# EasyEDA Pro project ProProject_SmartNixieClock_2023-12-15.epro, board Main_1
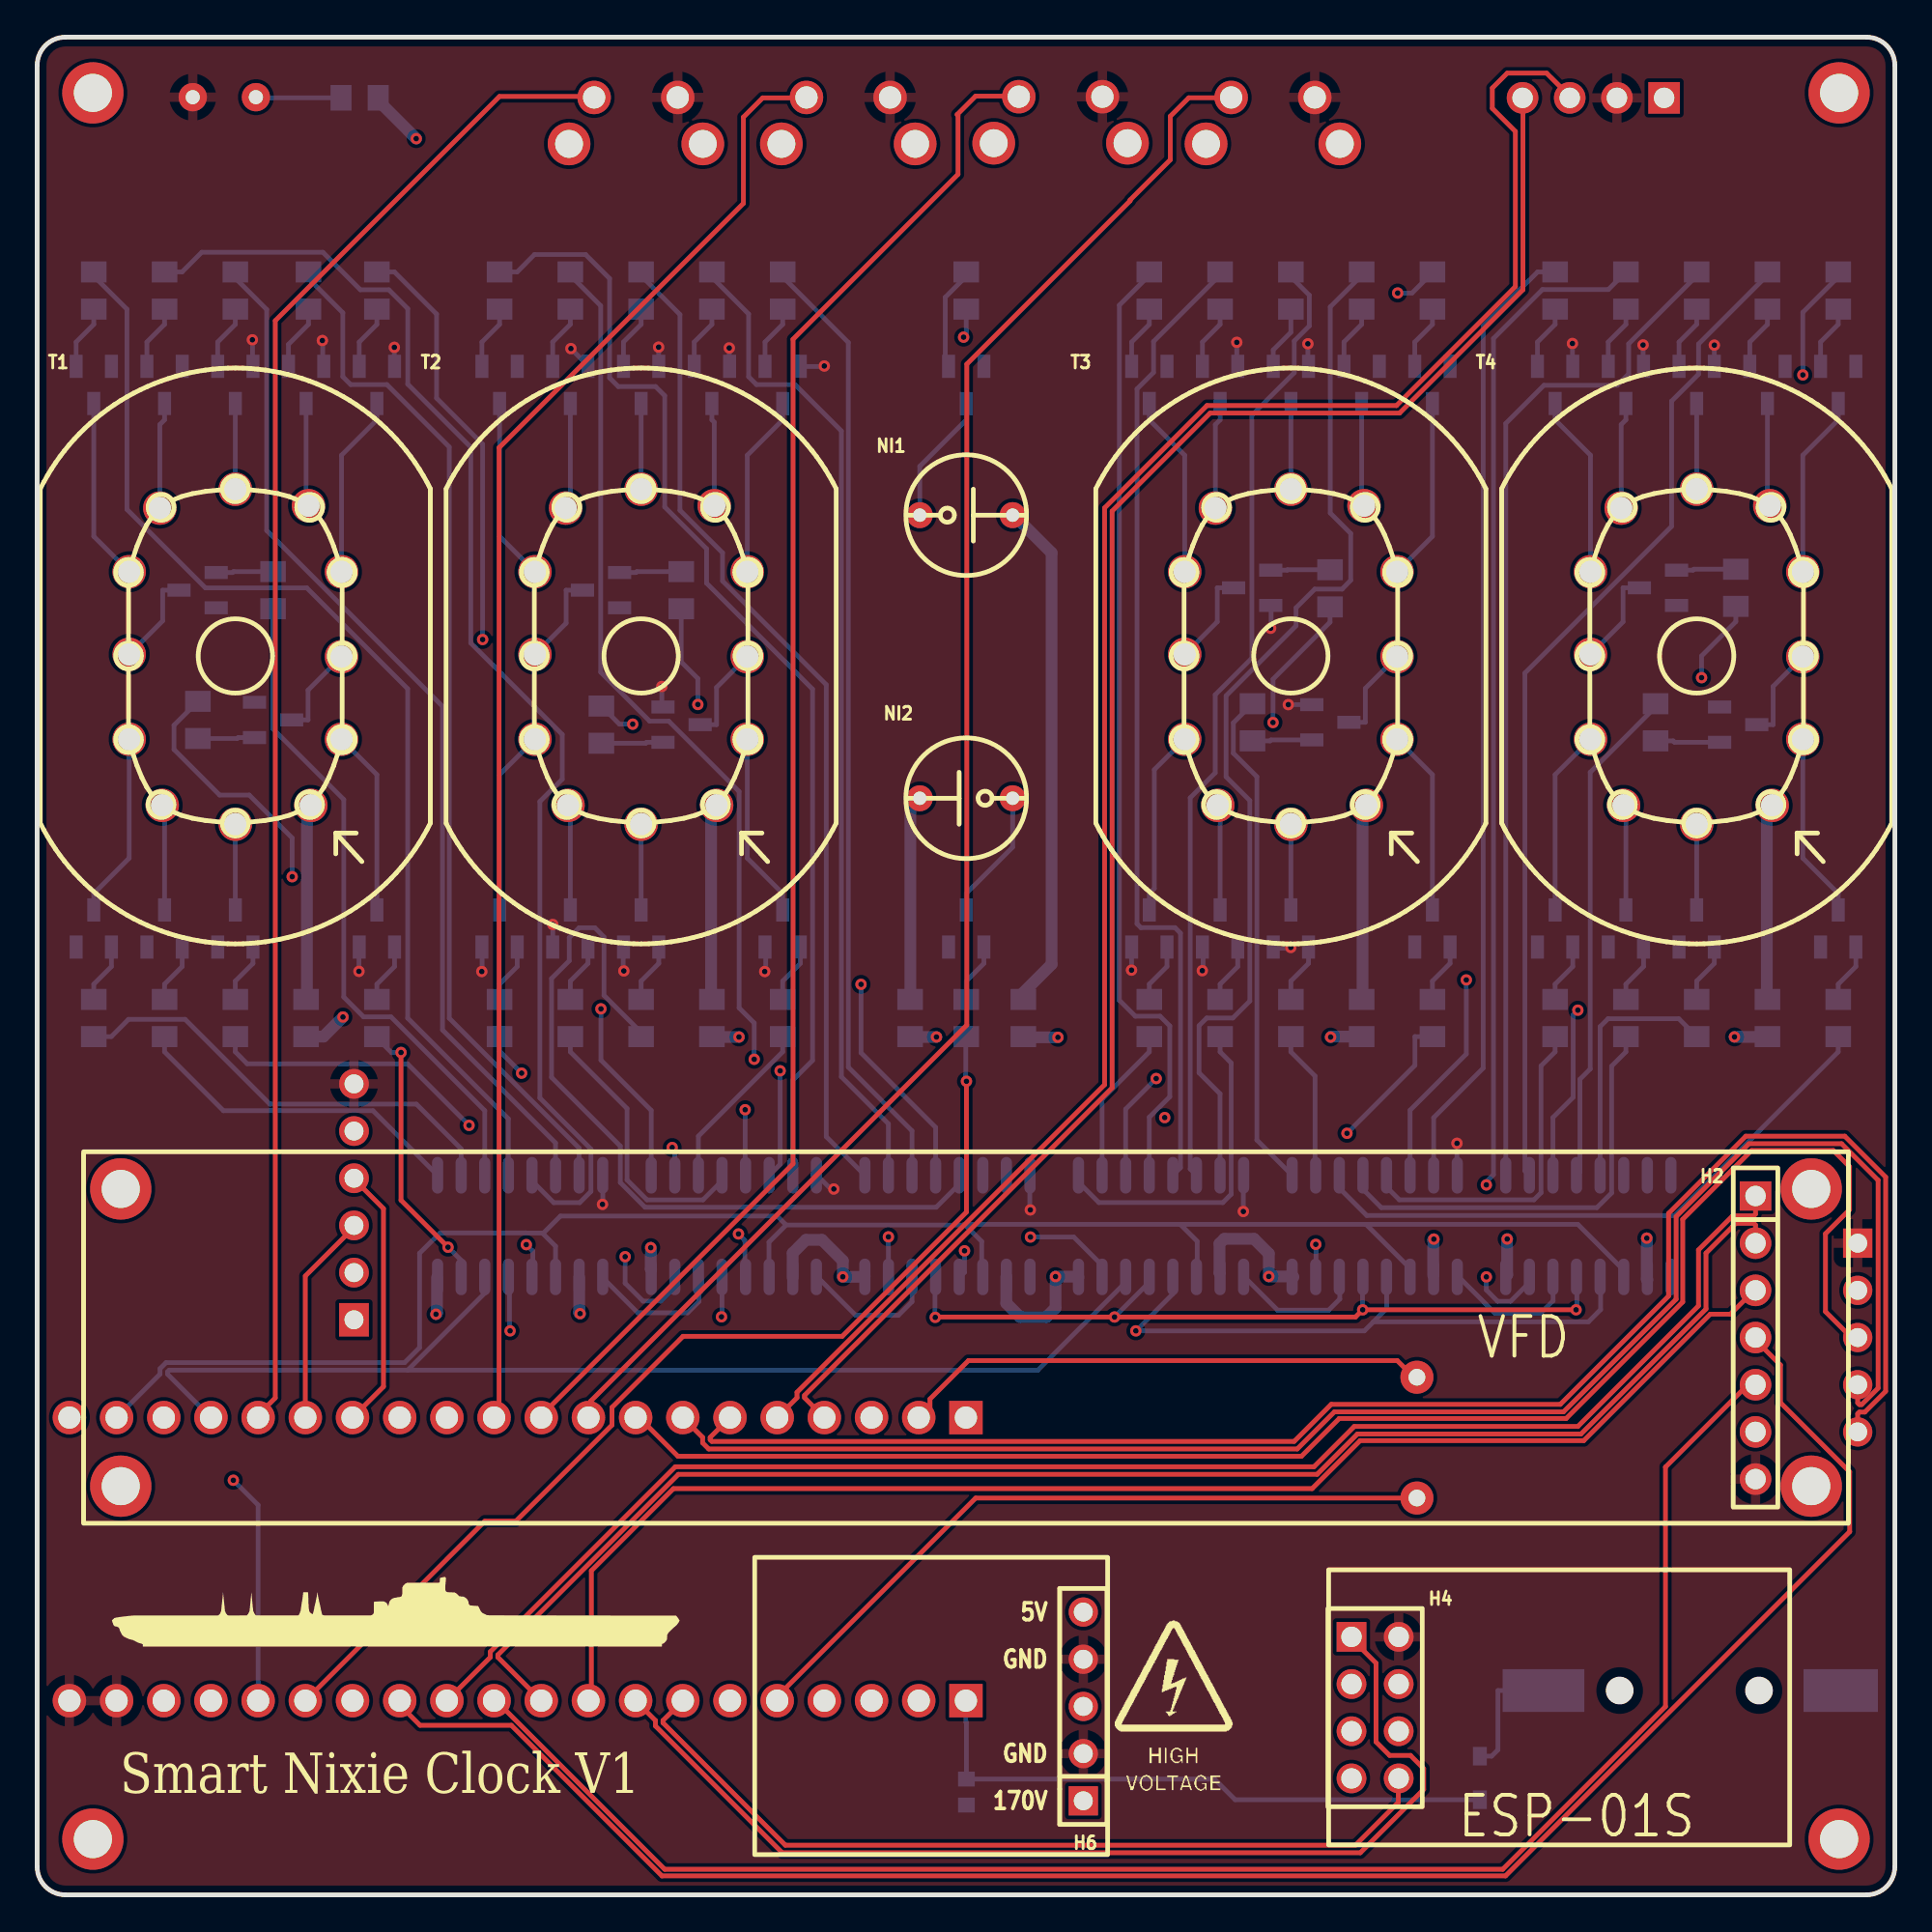
[diagram p2: board, top side]
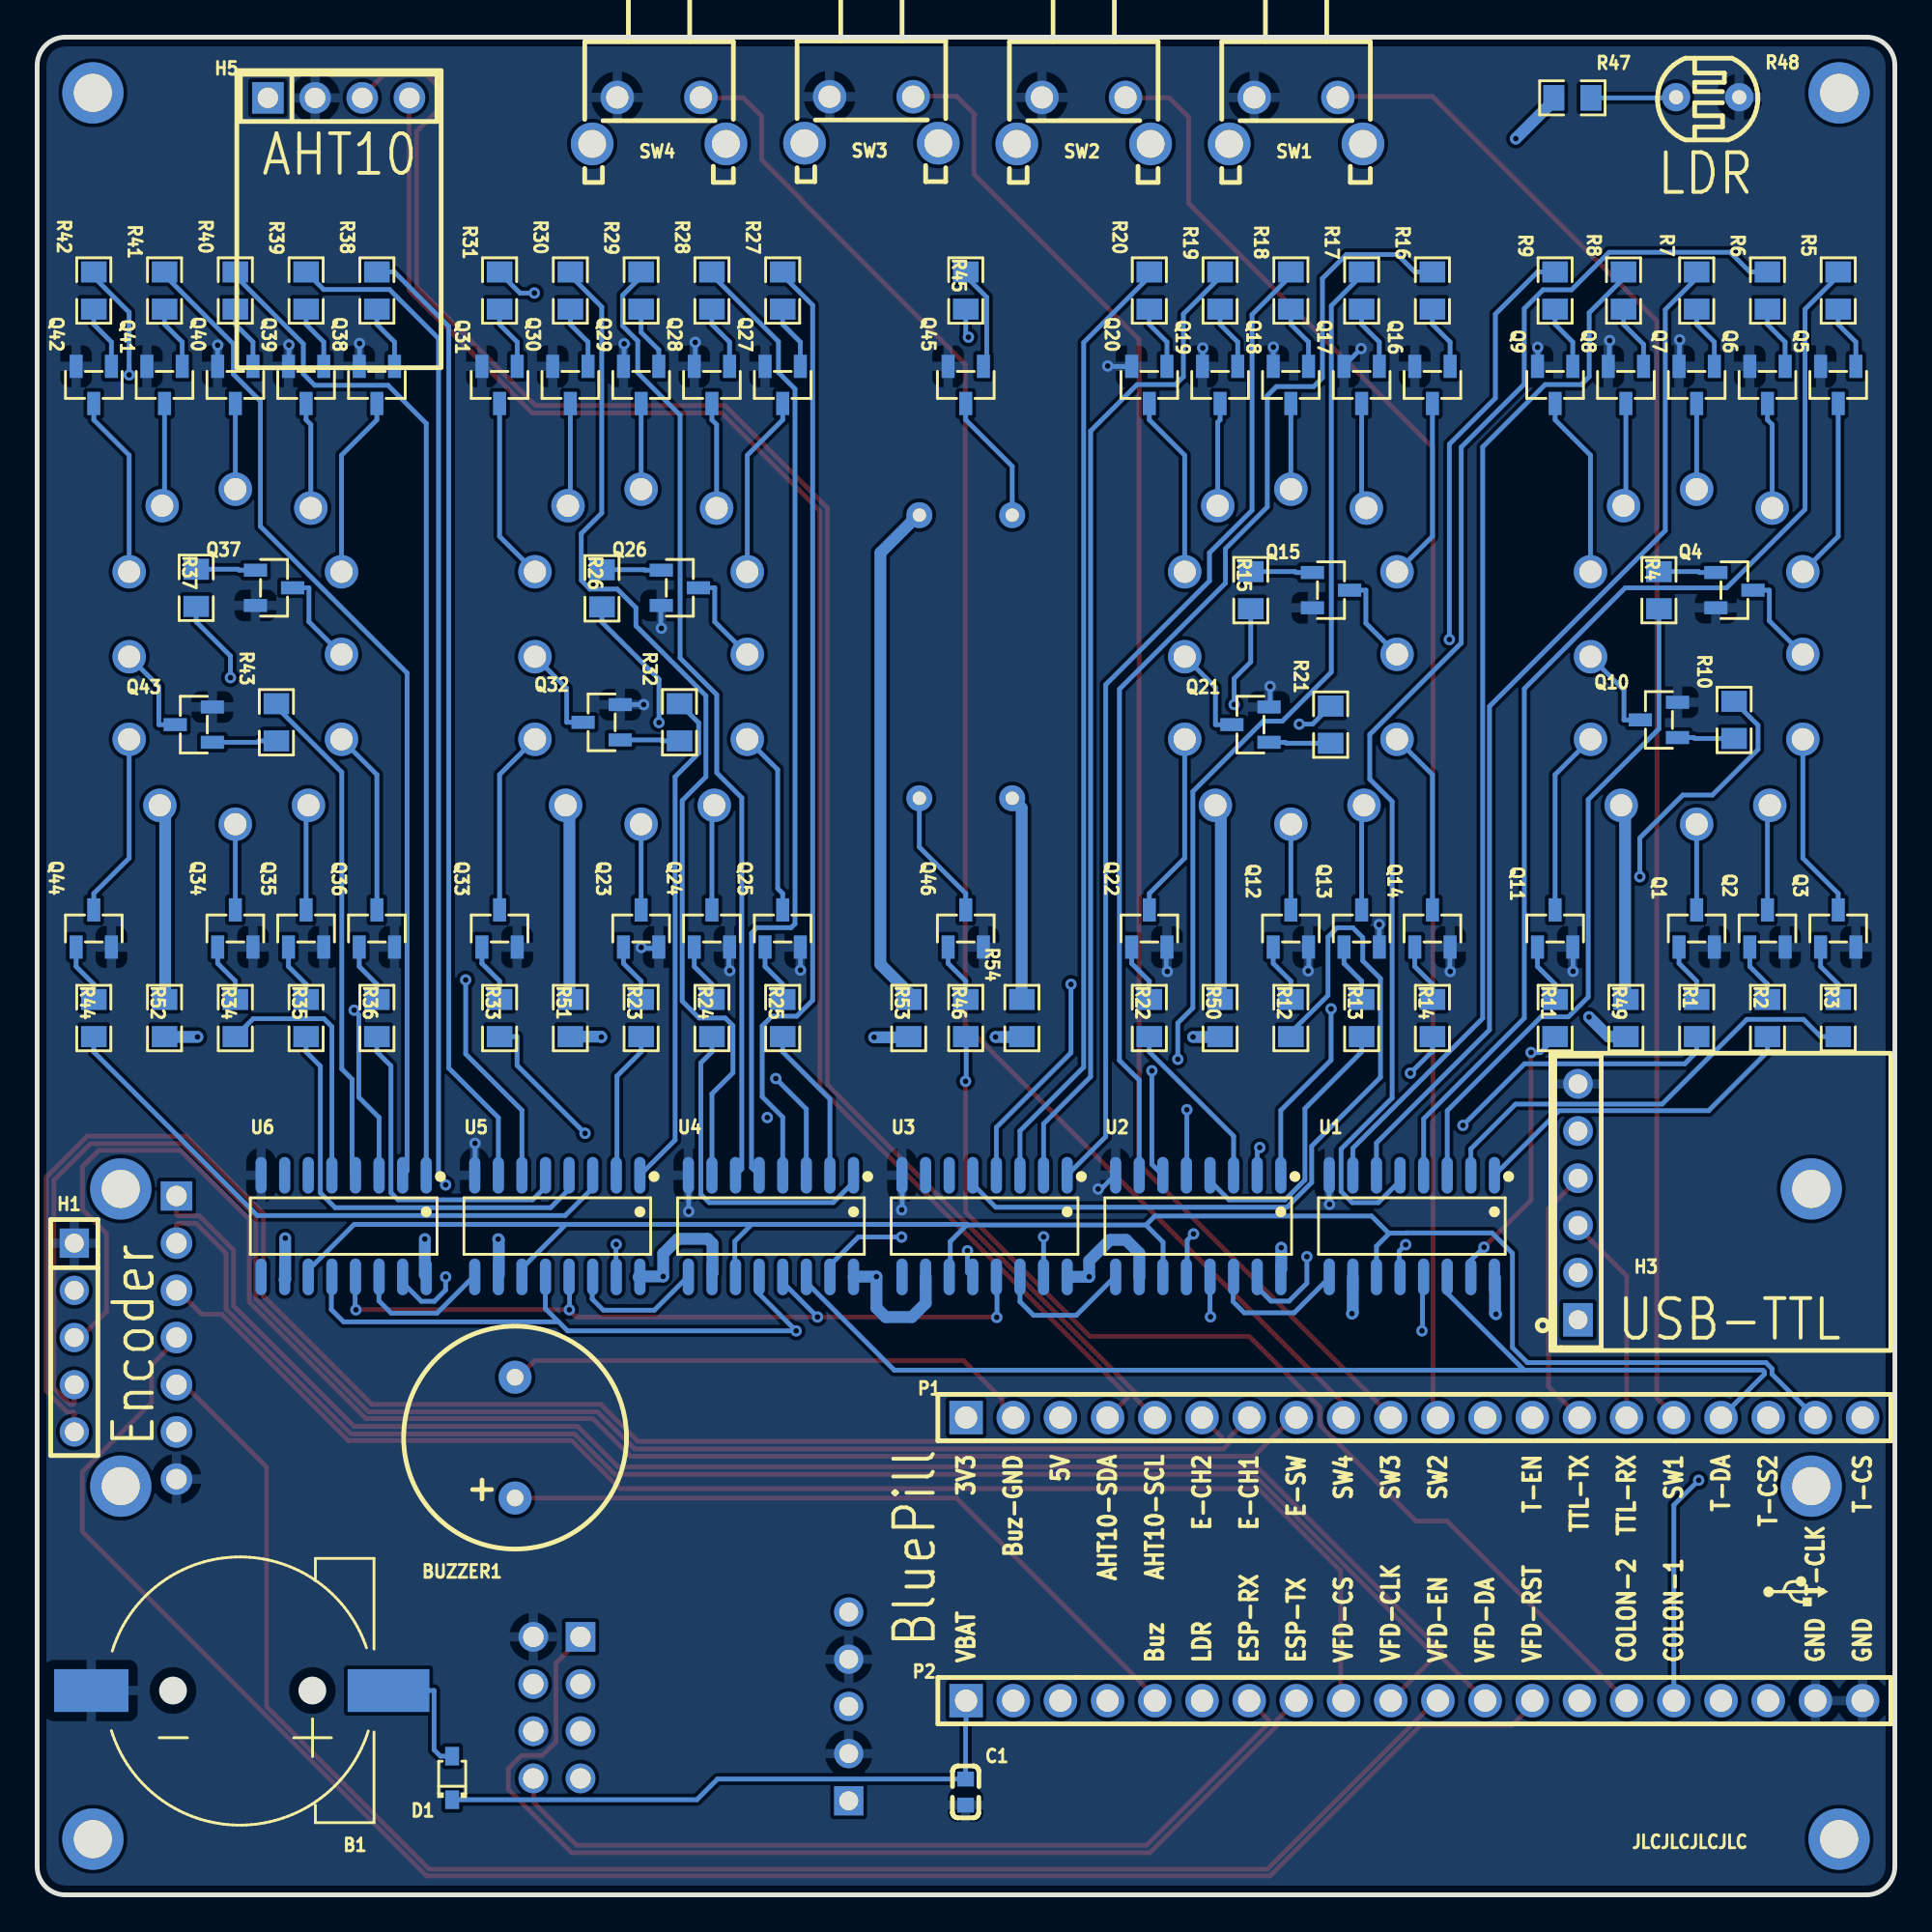
[diagram p3: board, bottom side, seen from below]

Outline 100 x 100 mm; copper layers: Top Layer, Inner1, Inner2, Bottom Layer. Coordinates in mm from the lower left corner of the outline.
Outline path: 0,98.48 0,1.52 arc(0.45,0.45) 1.52,0 98.48,0 arc(99.55,0.45) 100,1.52 100,98.48 arc(99.55,99.55) 98.48,100 1.52,100 arc(0.45,99.55) 0,98.48
Stack: Top Layer 0.035mm 外层铜厚1oz / Dielectric1 0.2104mm 7628 RC49% 8.6mil / Inner1 0.0152mm 内层铜厚 / Dielectric2 1.065mm 1.1mm H/HOZ 含铜 / Inner2 0.0152mm 内层铜厚 / Dielectric3 0.2104mm 7628 RC49% 8.6mil / Bottom Layer 0.035mm 外层铜厚1oz

## Design rules (mm)
template: 用户自定义配置
spacing copperThickness1oz (default): track to track 0.102, other pairs 0.152 to 0.3
spacing copperThickness2oz: track to track 0.203, other pairs 0.152 to 0.3
spacing copperThicknessInner0.5oz: track to track 0.089, other pairs 0.152 to 0.3
track width copperThickness1oz (default): min 0.102, default 0.254, max 2.54
track width copperThickness2oz: min 0.203, default 0.254, max 2.54
track width copperThickness0.5oz: min 0.089, default 0.254, max 2.54
track width +5V: min 0.635, default 0.635, max 2.54
track width +3V3: min 0.635, default 0.635, max 2.54
track width +170V: min 0.635, default 0.635, max 2.54
differential pair differentialPair (default): width min 0.127, default 0.254, max 2.54; gap min 0.152, default 0.152
via viaSize (default): diameter min 0.3, default 0.61, max 10; hole min 0.201, default 0.305, max 6.299
net +5V uses +5V
net $1N105872 uses +170V
net $1N105896 uses +170V
net $1N105920 uses +170V
net $1N105944 uses +170V
net $1N105947 uses +170V
net $1N105948 uses +170V
net +3V3 uses +3V3
net +170V uses +170V

## Placement (name value [footprint] x y rotation side)
B1  CR1220-2  [BAT-SMD_CR1220-2]  89.09 11 0 bottom
BUZZER1  2048Hz  [BUZ-TH_BD12.0-P6.50-D0.6-FD]  74.27 24.61 90 bottom
C1  100nF  [C0603]  50.02 5.53 270 bottom
D1  1N4148WS  [SOD-323_L1.8-W1.3-LS2.5-RD]  77.66 6.29 90 bottom
H1  PM254V-11-05-H85  [HDR-TH_5P-P2.54-V-F]  98 30 270 bottom
H2  PM254V-11-07-H85  [HDR-TH_7P-P2.54-V-F]  92.5 30 270 top
H3  PM254V-11-06-H85  [HDR-TH_6P-P2.54-V-F]  17.06 37.31 90 bottom
H4  PM254V-12-08-H85  [HDR-TH_8P-P2.54-V-F-R2-C4-S2.54]  72.02 10.08 270 top
H5  PM254V-11-04-H85  [HDR-TH_4P-P2.54-V-F]  83.77 96.73 180 bottom
H6  PM254V-11-05-H85  [HDR-TH_5P-P2.54-V-F]  56.31 10.14 90 top
NI1  -  [INS-1]  50.01 74.27 0 top
NI2  -  [INS-1]  50.01 59.03 180 top
NOREF  -  [Pad_e46]  95.5 22 0 top
NOREF#2  -  [Pad_e40]  4.5 38 0 top
NOREF#3  -  [Pad_e51]  95.5 38 0 top
NOREF#4  -  [Pad_e54]  97 3 0 top
NOREF#5  -  [Pad_e58]  3 3 0 top
NOREF#6  -  [Pad_e45]  4.5 22 0 top
NOREF#7  -  [Pad_e55]  97 97 0 top
NOREF#8  -  [Pad_e57]  3 97 0 top
P1  2.54-1*20P母  [HDR-TH_20P-P2.54-V-F]  25.87 25.69 180 bottom
P2  2.54-1*20P母  [HDR-TH_20P-P2.54-V-F]  25.87 10.45 180 bottom
Q1  13001  [SOT-23-3_L2.9-W1.3-P1.90-LS2.4-BR]  10.67 52.02 270 bottom
Q2  13001  [SOT-23-3_L2.9-W1.3-P1.90-LS2.4-BR]  6.86 52.02 270 bottom
Q3  13001  [SOT-23-3_L2.9-W1.3-P1.90-LS2.4-BR]  3.05 52.02 270 bottom
Q4  13001  [SOT-23-3_L2.9-W1.3-P1.90-LS2.4-BR]  8.64 70.23 0 bottom
Q5  13001  [SOT-23-3_L2.9-W1.3-P1.90-LS2.4-BR]  3.05 81.28 90 bottom
Q6  13001  [SOT-23-3_L2.9-W1.3-P1.90-LS2.4-BR]  6.86 81.28 90 bottom
Q7  13001  [SOT-23-3_L2.9-W1.3-P1.90-LS2.4-BR]  10.67 81.28 90 bottom
Q8  13001  [SOT-23-3_L2.9-W1.3-P1.90-LS2.4-BR]  14.48 81.28 90 bottom
Q9  13001  [SOT-23-3_L2.9-W1.3-P1.90-LS2.4-BR]  18.29 81.28 90 bottom
Q10  13001  [SOT-23-3_L2.9-W1.3-P1.90-LS2.4-BR]  12.7 63.25 180 bottom
Q11  13001  [SOT-23-3_L2.9-W1.3-P1.90-LS2.4-BR]  18.29 52.02 270 bottom
Q12  13001  [SOT-23-3_L2.9-W1.3-P1.90-LS2.4-BR]  32.51 52.02 270 bottom
Q13  13001  [SOT-23-3_L2.9-W1.3-P1.90-LS2.4-BR]  28.7 52.02 270 bottom
Q14  13001  [SOT-23-3_L2.9-W1.3-P1.90-LS2.4-BR]  24.89 52.02 270 bottom
Q15  13001  [SOT-23-3_L2.9-W1.3-P1.90-LS2.4-BR]  30.35 70.23 0 bottom
Q16  13001  [SOT-23-3_L2.9-W1.3-P1.90-LS2.4-BR]  24.89 81.28 90 bottom
Q17  13001  [SOT-23-3_L2.9-W1.3-P1.90-LS2.4-BR]  28.7 81.28 90 bottom
Q18  13001  [SOT-23-3_L2.9-W1.3-P1.90-LS2.4-BR]  32.51 81.28 90 bottom
Q19  13001  [SOT-23-3_L2.9-W1.3-P1.90-LS2.4-BR]  36.32 81.28 90 bottom
Q20  13001  [SOT-23-3_L2.9-W1.3-P1.90-LS2.4-BR]  40.13 81.28 90 bottom
Q21  13001  [SOT-23-3_L2.9-W1.3-P1.90-LS2.4-BR]  34.69 62.99 180 bottom
Q22  13001  [SOT-23-3_L2.9-W1.3-P1.90-LS2.4-BR]  40.13 52.02 270 bottom
Q23  13001  [SOT-23-3_L2.9-W1.3-P1.90-LS2.4-BR]  67.49 52.02 270 bottom
Q24  13001  [SOT-23-3_L2.9-W1.3-P1.90-LS2.4-BR]  63.68 52.02 270 bottom
Q25  13001  [SOT-23-3_L2.9-W1.3-P1.90-LS2.4-BR]  59.87 52.02 270 bottom
Q26  13001  [SOT-23-3_L2.9-W1.3-P1.90-LS2.4-BR]  65.41 70.36 0 bottom
Q27  13001  [SOT-23-3_L2.9-W1.3-P1.90-LS2.4-BR]  59.87 81.28 90 bottom
Q28  13001  [SOT-23-3_L2.9-W1.3-P1.90-LS2.4-BR]  63.68 81.28 90 bottom
Q29  13001  [SOT-23-3_L2.9-W1.3-P1.90-LS2.4-BR]  67.49 81.28 90 bottom
Q30  13001  [SOT-23-3_L2.9-W1.3-P1.90-LS2.4-BR]  71.3 81.28 90 bottom
Q31  13001  [SOT-23-3_L2.9-W1.3-P1.90-LS2.4-BR]  75.11 81.28 90 bottom
Q32  13001  [SOT-23-3_L2.9-W1.3-P1.90-LS2.4-BR]  69.61 63.12 180 bottom
Q33  13001  [SOT-23-3_L2.9-W1.3-P1.90-LS2.4-BR]  75.11 52.02 270 bottom
Q34  13001  [SOT-23-3_L2.9-W1.3-P1.90-LS2.4-BR]  89.33 52.02 270 bottom
Q35  13001  [SOT-23-3_L2.9-W1.3-P1.90-LS2.4-BR]  85.52 52.02 270 bottom
Q36  13001  [SOT-23-3_L2.9-W1.3-P1.90-LS2.4-BR]  81.71 52.02 270 bottom
Q37  13001  [SOT-23-3_L2.9-W1.3-P1.90-LS2.4-BR]  87.25 70.36 0 bottom
Q38  13001  [SOT-23-3_L2.9-W1.3-P1.90-LS2.4-BR]  81.71 81.28 90 bottom
Q39  13001  [SOT-23-3_L2.9-W1.3-P1.90-LS2.4-BR]  85.52 81.28 90 bottom
Q40  13001  [SOT-23-3_L2.9-W1.3-P1.90-LS2.4-BR]  89.33 81.28 90 bottom
Q41  13001  [SOT-23-3_L2.9-W1.3-P1.90-LS2.4-BR]  93.14 81.28 90 bottom
Q42  13001  [SOT-23-3_L2.9-W1.3-P1.90-LS2.4-BR]  96.95 81.28 90 bottom
Q43  13001  [SOT-23-3_L2.9-W1.3-P1.90-LS2.4-BR]  91.57 62.99 180 bottom
Q44  13001  [SOT-23-3_L2.9-W1.3-P1.90-LS2.4-BR]  96.95 52.02 270 bottom
Q45  13001  [SOT-23-3_L2.9-W1.3-P1.90-LS2.4-BR]  50.01 81.28 90 bottom
Q46  13001  [SOT-23-3_L2.9-W1.3-P1.90-LS2.4-BR]  50.01 52.02 270 bottom
R1  1kΩ  [R0805]  10.67 47.2 90 bottom
R2  1kΩ  [R0805]  6.86 47.2 90 bottom
R3  1kΩ  [R0805]  3.05 47.2 90 bottom
R4  1kΩ  [R0805]  12.7 70.23 90 bottom
R5  1kΩ  [R0805]  3.05 86.36 270 bottom
R6  1kΩ  [R0805]  6.86 86.36 270 bottom
R7  1kΩ  [R0805]  10.67 86.36 270 bottom
R8  1kΩ  [R0805]  14.61 86.36 270 bottom
R9  1kΩ  [R0805]  18.29 86.36 270 bottom
R10  1kΩ  [R0805]  8.65 63.25 270 bottom
R11  1kΩ  [R0805]  18.29 47.2 90 bottom
R12  1kΩ  [R0805]  32.51 47.2 90 bottom
R13  1kΩ  [R0805]  28.7 47.2 90 bottom
R14  1kΩ  [R0805]  24.89 47.2 90 bottom
R15  1kΩ  [R0805]  34.67 70.23 90 bottom
R16  1kΩ  [R0805]  24.89 86.36 270 bottom
R17  1kΩ  [R0805]  28.7 86.36 270 bottom
R18  1kΩ  [R0805]  32.51 86.36 270 bottom
R19  1kΩ  [R0805]  36.32 86.36 270 bottom
R20  1kΩ  [R0805]  40.13 86.36 270 bottom
R21  1kΩ  [R0805]  30.37 62.99 270 bottom
R22  1kΩ  [R0805]  40.13 47.2 90 bottom
R23  1kΩ  [R0805]  67.49 47.2 90 bottom
R24  1kΩ  [R0805]  63.68 47.2 90 bottom
R25  1kΩ  [R0805]  59.87 47.2 90 bottom
R26  1kΩ  [R0805]  69.6 70.33 90 bottom
R27  1kΩ  [R0805]  59.87 86.36 270 bottom
R28  1kΩ  [R0805]  63.68 86.36 270 bottom
R29  1kΩ  [R0805]  67.49 86.36 270 bottom
R30  1kΩ  [R0805]  71.3 86.36 270 bottom
R31  1kΩ  [R0805]  75.11 86.36 270 bottom
R32  1kΩ  [R0805]  65.42 63.12 270 bottom
R33  1kΩ  [R0805]  75.11 47.2 90 bottom
R34  1kΩ  [R0805]  89.33 47.2 90 bottom
R35  1kΩ  [R0805]  85.52 47.2 90 bottom
R36  1kΩ  [R0805]  81.71 47.2 90 bottom
R37  1kΩ  [R0805]  91.44 70.36 90 bottom
R38  1kΩ  [R0805]  81.71 86.36 270 bottom
R39  1kΩ  [R0805]  85.52 86.36 270 bottom
R40  1kΩ  [R0805]  89.33 86.36 270 bottom
R41  1kΩ  [R0805]  93.14 86.36 270 bottom
R42  1kΩ  [R0805]  96.95 86.36 270 bottom
R43  1kΩ  [R0805]  87.12 63.12 270 bottom
R44  1kΩ  [R0805]  96.95 47.2 90 bottom
R45  1kΩ  [R0805]  50.01 86.36 90 bottom
R46  1kΩ  [R0805]  50.01 47.2 90 bottom
R47  10kΩ  [R0805]  17.36 96.73 0 bottom
R48  GL5516  [RES-TH_L5.1-W4.3-P3.40-D0.5]  10.08 96.77 90 bottom
R49  20kΩ  [R0805]  14.48 47.2 90 bottom
R50  20kΩ  [R0805]  36.32 47.2 90 bottom
R51  20kΩ  [R0805]  71.3 47.2 90 bottom
R52  20kΩ  [R0805]  93.14 47.2 90 bottom
R53  200kΩ  [R0805]  53.09 47.2 90 bottom
R54  200kΩ  [R0805]  46.99 47.2 270 bottom
SW1  TS-1093C-A13B2-D1  [SW-TH_TS-1093C-A13B3-D1]  32.23 95.5 0 bottom
SW2  TS-1093C-A13B2-D1  [SW-TH_TS-1093C-A13B3-D1]  43.66 95.5 0 bottom
SW3  TS-1093C-A13B2-D1  [SW-TH_TS-1093C-A13B3-D1]  55.09 95.54 0 bottom
SW4  TS-1093C-A13B2-D1  [SW-TH_TS-1093C-A13B3-D1]  66.52 95.5 0 bottom
T1  IN-12b辉光管  [IN-12b(正常,插針在上面)]  10.67 66.65 0 top
T2  IN-12b辉光管  [IN-12b(正常,插針在上面)]  32.51 66.65 0 top
T3  IN-12b辉光管  [IN-12b(正常,插針在上面)]  67.49 66.65 0 top
T4  IN-12b辉光管  [IN-12b(正常,插針在上面)]  89.33 66.65 0 top
U1  74HC595D,118  [SOIC-16_L9.9-W3.9-P1.27-LS6.0-BL]  26 36 0 bottom
U2  74HC595D,118  [SOIC-16_L9.9-W3.9-P1.27-LS6.0-BL]  37.5 36 0 bottom
U3  74HC595D,118  [SOIC-16_L9.9-W3.9-P1.27-LS6.0-BL]  49 36 0 bottom
U4  74HC595D,118  [SOIC-16_L9.9-W3.9-P1.27-LS6.0-BL]  60.5 36 0 bottom
U5  74HC595D,118  [SOIC-16_L9.9-W3.9-P1.27-LS6.0-BL]  72 36 0 bottom
U6  74HC595D,118  [SOIC-16_L9.9-W3.9-P1.27-LS6.0-BL]  83.5 36 0 bottom

## Footprints (pads in the part's own frame, mm; a bottom-side part is the same pattern mirrored in y, then rotated)
BAT-SMD_CR1220-2
  rect 4.4x2.3 smd: 1(-8,0)
  rect 4x2.3 smd: 2(8,0)
BUZ-TH_BD12.0-P6.50-D0.6-FD
  round 1.778 hole 0.9: 1(-3.251,0) 2(3.251,0)
C0603
  rect 0.8x0.9 smd: 1(-0.7,0) 2(0.7,0)
HDR-TH_4P-P2.54-V-F
  rect 1.7x1.7 hole 1.1: 1(-3.81,0)
  round 1.7 hole 1.1: 2(-1.27,0) 3(1.27,0) 4(3.81,0)
HDR-TH_5P-P2.54-V-F
  rect 1.575x1.575 hole 1.02: 1(-5.08,0)
  round 1.575 hole 1.02: 2(-2.54,0) 3(0,0) 4(2.54,0) 5(5.08,0)
HDR-TH_6P-P2.54-V-F
  rect 1.8x1.6 hole 1.02: 1(-6.35,0)
  round 1.6 hole 1.02: 2(-3.81,0) 3(-1.27,0) 4(1.27,0) 5(3.81,0) 6(6.35,0)
HDR-TH_7P-P2.54-V-F
  rect 1.575x1.7 hole 1.1: 1(-7.62,0)
  round 1.7 hole 1.1: 2(-5.08,0) 3(-2.54,0) 4(0,0) 5(2.54,0) 6(5.08,0) 7(7.62,0)
HDR-TH_8P-P2.54-V-F-R2-C4-S2.54
  rect 1.6x1.6 hole 1.1: 1(-3.81,-1.27)
  round 1.6 hole 1.1: 2(-3.81,1.27) 3(-1.27,-1.27) 4(-1.27,1.27) 5(1.27,-1.27) 6(1.27,1.27) 7(3.81,-1.27) 8(3.81,1.27)
HDR-TH_20P-P2.54-V-F
  rect 1.8x1.8 hole 1.2: 1(-24.13,0)
  round 1.8 hole 1.2: 2(-21.59,0) 3(-19.05,0) 4(-16.51,0) 5(-13.97,0) 6(-11.43,0) 7(-8.89,0) 8(-6.35,0) 9(-3.81,0) 10(-1.27,0) 11(1.27,0) 12(3.81,0) 13(6.35,0) 14(8.89,0) 15(11.43,0) 16(13.97,0) 17(16.51,0) 18(19.05,0) 19(21.59,0) 20(24.13,0)
IN-12b(正常,插針在上面)
  round 1.8 hole 1.2x1.05: 1(4.064,-8.001) 2(5.715,-4.445) 3(5.715,0) 4(5.715,4.572) 5(3.937,8.128) 6(0,9.017) 7(-4.064,8.001) 8(-5.715,4.572) 9(-5.715,0.127) 10(-5.715,-4.445) 11(-3.937,-8.001) 12(0,-9.017)
INS-1
  round 1.4 hole 0.72: 1(2.5,0) 2(-2.5,0)
Pad_e40
  round 3.3 hole 2.05: M2(0,0)
Pad_e45
  round 3.3 hole 2.05: M2(0,0)
Pad_e46
  round 3.3 hole 2.05: M2(0,0)
Pad_e51
  round 3.3 hole 2.05: M2(0,0)
Pad_e54
  round 3.3 hole 2.05: M2(0,0)
Pad_e55
  round 3.3 hole 2.05: M2(0,0)
Pad_e57
  round 3.3 hole 2.05: M2(0,0)
Pad_e58
  round 3.3 hole 2.05: M2(0,0)
R0805
  rect 1.133x1.377 smd: 1(-1,0) 2(1,0)
RES-TH_L5.1-W4.3-P3.40-D0.5
  round 1.524 hole 0.762: 1(0,1.7) 2(0,-1.7)
SOD-323_L1.8-W1.3-LS2.5-RD
  rect 1x0.75 smd: 1(-1.173,0) 2(1.173,0)
SOIC-16_L9.9-W3.9-P1.27-LS6.0-BL
  oval 0.602x1.971 smd: 1(-4.445,-2.736) 2(-3.175,-2.736) 3(-1.905,-2.736) 4(-0.635,-2.736) 5(0.635,-2.736) 6(1.905,-2.736) 7(3.175,-2.736) 8(4.445,-2.736) 9(4.445,2.736) 10(3.175,2.736) 11(1.905,2.736) 12(0.635,2.736) 13(-0.635,2.736) 14(-1.905,2.736) 15(-3.175,2.736) 16(-4.445,2.736)
SOT-23-3_L2.9-W1.3-P1.90-LS2.4-BR
  rect 1.25x0.7 smd: 1(1,-0.95) 2(1,0.95) 3(-1,0)
SW-TH_TS-1093C-A13B3-D1
  round 1.8 hole 1.2: 1(-2.25,-1.25) 2(2.25,-1.25)
  round 2.3 hole 1.5: 3(-3.6,1.25) 4(3.6,1.25)

## Nets
As in the schematic.

Pads without a net: H3 1 2; H4 3 4 5 6; H6 3; NOREF M2; NOREF#2 M2; NOREF#3 M2; NOREF#4 M2; NOREF#5 M2; NOREF#6 M2; NOREF#7 M2; NOREF#8 M2; P1 12; P2 2 3 4 14 17 18; SW1 3 4; SW2 3 4; SW3 3 4; SW4 3 4; U3 6 7 9; U6 6 7 9

## Via types
v1: diameter 0.61, hole 0.305, Top Layer to Bottom Layer, 86 vias

## Routing (per net, layer and track width the routed paths; a pad name or vN(x,y) marks a point on that pad's centre or on a via; arc(x,y) is an arc through that point)
+3V3: length 123.9
  Inner1 w0.635: 70.79,6.24 69.44,6.24 49.95,25.73
  Inner2 w0.635: 20.49,94.47 20.5,94.47 23.79,91.17 41.1,91.17 43.18,89.09 43.11,89.02 43.11,86.12 51.31,77.92 51.31,27.15 50.09,25.93
  Bottom Layer w0.635: 18.34,96.71 18.34,96.6 v1(20.41,94.54)
+5V: length 292.6
  Inner1 w0.635: 56.38,15.23 55.44,15.23 44.99,25.69 ; 27.03,31.3 29.12,31.3 29.13,31.31 31.19,31.31 33.02,33.14 33.02,34.78 ; 27.03,31.3 17.12,41.2 ; 27.03,31.3 30.68,27.65 43.09,27.65 44.99,25.75 ; 27.03,31.3 21.5,31.3 ; 44.89,25.65 48.79,29.55 83.18,29.55 ; 98.19,32.53 97.47,32.53 95.39,30.46 95.39,27.98 92.55,25.14 ; 83.18,29.55 87.78,24.96 92.46,24.96 92.51,25 ; 83.18,29.55 90.22,36.59 90.22,41.62 96.93,48.33 96.93,92.24 92.6,96.57 87.69,96.57 ; 33.02,34.78 41.75,34.78 43.27,33.25 54.8,33.25 54.8,33.26 66.21,33.26 66.22,33.25 73.14,33.25 75.13,35.24
  Inner2 w0.635: v1(75.18,35.3) 79.13,35.3 v1(79.13,35.3) 86.6,35.3 v1(86.65,35.35)
  Bottom Layer w0.635: 29.18,33.24 29.18,31.33 v1(29.23,31.29) ; 21.53,33.22 21.53,31.31 v1(21.47,31.26) ; v1(75.18,35.3) 75.15,35.26 75.15,33.35 ; v1(33.03,34.84) 33.03,33.69 33.05,33.67 ; v1(79.13,35.3) 79.13,33.38 79.1,33.35 ; v1(86.65,35.35) 86.65,33.15 86.68,33.11 ; 63.65,33.47 63.65,33.48 63.65,35.05 63.9,35.31 65.51,35.31 66.3,34.52 v1(66.3,33.29) 67.59,33.29 67.63,33.26 ; 40.67,33.24 40.67,34.54 41.38,35.26 42.25,35.26 43.37,34.13 v1(43.37,33.27) 44.52,33.27 44.54,33.29 ; 52.17,33.26 52.17,31.85 52.92,31.1 54.32,31.1 54.82,31.6 v1(54.82,33.28) 56.03,33.28 56.05,33.26
+170V: length 128.2
  Inner1 w0.635: 91.41,46.18 91.4,46.18 69.27,46.18 64.93,41.84 v1(60.7,41.84) 56.35,46.19 17.55,46.19 16.47,47.27
  Inner2 w0.635: 60.71,41.92 60.71,9.92 56.22,5.44
  Bottom Layer w0.635: 71.29,46.2 69.65,46.2 v1(69.63,46.17) ; 36.27,46.17 36.27,46.18 v1(37.78,46.18) ; 52.95,46.22 53.01,46.16 v1(54.95,46.16) ; 93.11,46.18 v1(91.37,46.18) ; v1(48.41,46.18) 47.03,46.18 46.99,46.14 ; 14.45,46.2 15.41,46.2 v1(16.46,47.25)
GND: length 37
  Bottom Layer w0.254: v1(53.46,36.87) 53.44,36.9 53.44,38.74 ; v1(31.58,49.74) 31.55,49.77 31.55,51.02 ; 58.91,50.96 58.91,49.78 v1(58.91,49.78) ; 29.67,82.22 29.67,82.3 v1(28.73,83.24) ; v1(64.58,83.57) 64.58,82.36 64.57,82.35 ; 64.93,38.79 v1(64.93,36.79) ; v1(67.48,51) 67.44,50.95 66.54,50.95 ; v1(42.88,37.99) 42.72,37.99 41.96,38.76 ; 17.32,51 v1(17.32,49.71) ; 15.37,82.3 15.37,83.71 15.4,83.74 ; v1(66.4,68.18) 66.42,68.21 66.42,69.44 ; 41.13,82.27 42.34,82.27 v1(42.37,82.3) ; 62.76,51.04 62.76,49.79 v1(62.72,49.75) ; 39.22,51.07 39.22,49.76 v1(39.17,49.7) ; v1(37.26,83.27) 37.26,82.28 37.23,82.25 ; 68.4,82.42 68.4,82.43 v1(68.4,83.49) ; 86.51,82.25 86.45,82.32 v1(86.45,83.43) ; 76.4,38.74 76.43,38.78 v1(76.43,40.46) ; 30.45,38.78 30.45,37.19 v1(30.43,37.17) ; v1(82.65,83.51) 82.65,82.31 82.62,82.28 ; 27.82,50.83 27.76,50.9 v1(27.76,52.23) ; 33.65,63.88 33.63,63.9 v1(33.63,65.05) ; v1(23.94,49.7) 23.95,49.72 23.95,51.06 ; 19.19,82.31 19.23,82.34 v1(19.23,83.3) ; 90.3,82.18 90.28,82.2 v1(90.28,83.42) ; v1(33.46,83.31) 33.46,82.28 33.49,82.25 ; v1(67.35,64.07) 68.51,64.07 68.57,64.01 ; 11.58,83.68 11.59,83.67 11.59,82.28
  vias: v1(11.58,83.71) v1(15.35,83.67)
VBAT: length 32.3
  Bottom Layer w0.254: P2.1 50,9.3 50.02,9.27 50.02,6.23 63.38,6.23 64.49,5.12 77.66,5.12
AHT10-SCL: length 99.5
  Top Layer w0.254: 82.46,96.86 81.26,98.06 79.13,98.06 78.33,97.26 78.33,96.17 79.57,94.92 79.57,86.57 73.17,80.17 62.97,80.17 57.46,74.66 57.46,43.61 40.9,27.05 40.9,26.76 P1.5
AHT10-SDA: length 93.5
  Top Layer w0.254: P1.4 41.31,26.76 41.31,26.89 57.87,43.44 57.87,74.49 63.14,79.76 73.34,79.76 79.98,86.4 79.98,96.71 79.95,96.74
BUZZER: length 39.1
  Top Layer w0.254: 74.28,21.36 50.52,21.36 39.68,10.52
BUZZER-GND: length 28.3
  Top Layer w0.254: 74.12,27.86 73.22,28.76 50.13,28.76 48.06,26.69 48.06,25.66
C-COLON-1: length 110
  Inner1 w0.254: v1(49.87,83.85) 49.82,83.9 18.98,83.9 12.23,77.15 12.23,56.42 10.56,54.75 v1(10.56,22.32)
  Bottom Layer w0.254: v1(10.56,22.32) 11.89,20.98 P2.16 ; R45.1 50.01,83.99 v1(49.87,83.85)
C-COLON-2: length 56.5
  Top Layer w0.254: v1(50.02,43.8) 50.02,36.75 43.34,30.07 34.77,30.07 30.94,26.24 30.94,25.29 25.77,20.12 24.1,20.12 P2.15
  Bottom Layer w0.254: R46.1 49.99,46.18 49.99,43.83 v1(50.02,43.8)
C-T1-0: length 15
  Top Layer w0.254: v1(19.59,45.34) 19.59,37.39 v1(22.12,34.86)
  Bottom Layer w0.254: 22.83,33.3 22.83,34.15 v1(22.12,34.86) ; 19.57,45.34 19.08,45.34 18.26,46.16
C-T1-1: length 18.3
  Bottom Layer w0.254: R2.1 6.86,45.38 10.03,42.21 18.08,42.21 21.55,38.73
C-T1-2: length 24.5
  Bottom Layer w0.254: R3.1 3.99,46.2 4.92,47.13 7.97,47.13 12.53,42.57 20.41,42.57 22.82,40.16 U1.2
C-T1-3: length 36.1
  Bottom Layer w0.254: 12.7,69.23 12.7,62.77 16.5,58.96 16.5,48.33 17.57,47.26 19.05,47.26 24.09,42.21 24.09,38.73
C-T1-4: length 61.1
  Bottom Layer w0.254: R5.1 3.05,87.14 4.83,85.36 4.83,74.58 9.06,70.36 14.51,70.36 19.94,64.92 19.94,47.19 25.36,41.78 U1.4
C-T1-5: length 71.6
  Bottom Layer w0.254: R6.1 7.8,87.36 8.86,88.42 15.38,88.42 17.4,86.4 18.93,86.4 19.95,85.38 19.95,81.32 23.34,77.93 23.34,67.39 28.26,62.46 28.26,60.06 27.06,58.86 27.06,42.9 29.81,40.15 29.81,37.86 29.21,37.26 27.81,37.26 26.63,38.44 26.63,38.73
C-T1-6: length 55.8
  Bottom Layer w0.254: U1.6 27.9,40.47 21.82,46.56 21.82,63.98 12.36,73.44 12.36,85.34 10.67,87.03 R7.1
C-T1-7: length 55.8
  Bottom Layer w0.254: R8.1 14.61,87.02 16.45,85.17 16.45,81.72 16.88,81.3 18.83,81.3 22.18,77.94 22.18,47.19 29.17,40.2 29.17,38.73
C-T1-8: length 75.6
  Inner1 w0.254: v1(23.98,67.57) 23.98,66.09 12.99,55.1 12.99,49.51 28.15,34.35 v1(31.65,34.35)
  Bottom Layer w0.254: v1(31.65,34.35) 31.65,32.92 32.61,31.96 33.58,31.96 34.33,32.71 34.33,33.26 ; R9.1 19.23,87.36 21.5,85.09 21.5,80.57 23.98,78.09 v1(23.98,67.57)
C-T1-9: length 43.2
  Inner1 w0.254: v1(13.73,54.81) 20.84,47.69 v1(30.35,47.69)
  Bottom Layer w0.254: v1(30.35,47.69) 30.35,44.93 33.06,42.23 U2.1 ; 8.65,64.25 7.37,62.96 7.37,61.66 9.82,59.2 11.42,59.2 13.73,56.89 v1(13.73,54.81)
C-T1-DP: length 28
  Inner1 w0.254: v1(23.25,41.42) 24.44,40.23 v1(34.19,40.23)
  Bottom Layer w0.254: R1.1 10.67,45.38 11.31,44.73 19.94,44.73 v1(23.25,41.42) ; 34.33,38.73 34.33,40.09 v1(34.19,40.23)
C-T2-0: length 9.3
  Bottom Layer w0.254: U2.3 35.6,40.84 40.13,45.38 R22.1
C-T2-1: length 15.3
  Bottom Layer w0.254: R13.1 28.7,45.38 31.75,42.33 31.75,38.48 32.83,37.41 35.84,37.41 36.87,38.44 36.87,38.73
C-T2-2: length 18.9
  Inner1 w0.254: v1(26.08,44.23) 28.05,42.26 v1(38.11,42.26)
  Bottom Layer w0.254: U2.5 38.11,38.76 v1(38.11,42.26) ; R14.1 24.89,45.38 24.93,45.38 v1(26.08,44.23)
C-T2-3: length 32.9
  Inner2 w0.254: v1(35.56,64.08) 35.56,63.06 40,58.63 v1(40,44.36)
  Bottom Layer w0.254: 34.67,69.23 34.67,66.37 35.56,65.48 v1(35.56,64.08) ; v1(40,44.36) 40,39.32 39.41,38.73
C-T2-4: length 61.3
  Bottom Layer w0.254: R16.1 25.84,87.36 26.77,88.3 29.52,88.3 30.81,87.01 30.81,81.66 31.28,81.19 33.29,81.19 33.78,80.7 33.78,74.71 36.03,72.46 36.03,70.61 41.74,64.9 41.74,44.92 40.68,43.85 U2.7
C-T2-5: length 61.8
  Inner1 w0.254: v1(38.6,44.98) 38.6,43.23 45.82,36 v1(45.82,35.42)
  Bottom Layer w0.254: U3.15 v1(45.82,35.42) ; R17.1 28.7,87.18 30.34,85.54 30.34,65.82 32.97,63.18 34,63.18 37.79,59.39 37.79,47.74 38.6,46.93 v1(38.6,44.98)
C-T2-6: length 53.6
  Bottom Layer w0.254: 44.55,38.73 42.48,40.81 42.48,65.14 36.9,70.72 36.9,72.24 34.6,74.53 34.6,85.07 32.51,87.16 R18.1
C-T2-7: length 53.8
  Bottom Layer w0.254: U3.2 45.82,41.51 43.29,44.04 43.29,78.8 40.79,81.3 38.72,81.3 38.3,81.72 38.3,85.1 36.32,87.08 R19.1
C-T2-8: length 51.5
  Bottom Layer w0.254: R20.1 40.13,87.1 43.66,83.56 43.66,44.55 47.09,41.12 47.09,38.73
C-T2-9: length 34.8
  Inner1 w0.254: 44.35,49.01 44.35,53.56 34.88,63.02 v1(32.06,63.02)
  Bottom Layer w0.254: v1(44.35,49.01) 44.35,45.33 48.36,41.31 U3.4 ; 30.37,63.99 31.34,63.02 v1(32.06,63.02)
C-T2-DP: length 43.4
  Bottom Layer w0.254: R12.1 32.51,46.42 30.51,48.42 30.51,51.56 30.02,52.06 29.17,52.06 28.64,51.53 28.64,50.28 27.69,49.33 27.69,44.01 31.39,40.3 31.39,38.34 32.72,37.01 48.39,37.01 49.63,38.25 49.63,38.73
C-T3-0: length 32.1
  Inner1 w0.254: v1(70.51,40.99) 59.05,40.99 v1(53.47,35.41)
  Bottom Layer w0.254: v1(53.47,35.41) 55.8,35.41 57.33,33.89 57.33,33.26 ; R33.1 74.17,46.2 74.17,44.65 v1(70.51,40.99)
C-T3-1: length 18
  Bottom Layer w0.254: U4.1 56.06,38.36 57.15,37.27 63.82,37.27 64.27,37.72 64.27,44.78 63.68,45.38 R24.1
C-T3-2: length 8.5
  Bottom Layer w0.254: 57.33,38.73 57.33,42.84 59.87,45.38 R25.1
C-T3-3: length 35.2
  Inner2 w0.254: v1(60.24,43.94) 66.19,49.9 66.19,62.77 v1(66.53,63.11)
  Bottom Layer w0.254: R26.1 69.6,68.51 66.53,65.44 v1(66.53,63.11) ; U4.3 58.6,42.3 v1(60.24,43.94)
C-T3-4: length 51.7
  Bottom Layer w0.254: R27.1 59.87,87.18 58.25,85.57 58.25,48.16 59.11,47.3 60.45,47.3 60.97,46.77 60.97,42.96 59.87,41.86 59.87,38.73
C-T3-5: length 52.7
  Bottom Layer w0.254: R28.1 63.68,87.2 60.1,83.62 60.1,81.95 59.21,81.06 59.21,52.27 59.41,52.06 61.25,52.06 61.55,51.77 61.55,39.15 U4.5
C-T3-6: length 51.8
  Bottom Layer w0.254: 62.41,38.73 62.07,39.07 62.07,59.06 63.42,60.4 63.42,64.6 65.39,66.58 65.39,79.65 67.67,81.94 67.67,83.65 68.48,84.46 68.48,86.11 67.49,87.1 R29.1
C-T3-7: length 56.4
  Bottom Layer w0.254: R30.1 71.3,87.17 69.61,85.48 69.61,74.38 70.71,73.28 70.71,70.77 70.25,70.29 68.77,70.29 67.77,69.28 67.77,68.31 64,64.55 64,60.19 65.28,58.91 65.28,48.11 64.37,47.2 62.96,47.2 62.55,46.79 62.55,44.25 63.68,43.12 U4.7
C-T3-8: length 57.1
  Inner2 w0.254: v1(68.83,35.02) 68.83,81.83 73.25,86.25
  Bottom Layer w0.254: 75.11,87.32 74.01,86.23 v1(73.24,86.23) ; 68.84,33.27 68.84,35.03
C-T3-9: length 27.1
  Bottom Layer w0.254: 67.55,38.73 65.66,40.63 65.66,60.19 64.39,61.46 64.39,63.09 65.42,64.12 65.42,64.12
C-T3-DP: length 8
  Bottom Layer w0.254: R23.1 67.49,45.38 68.79,44.08 68.79,38.77 U5.2
C-T4-0: length 32.6
  Bottom Layer w0.254: R44.1 96.95,45.38 88.14,36.57 71.57,36.57 70.09,38.05 70.09,38.73
C-T4-1: length 23.6
  Bottom Layer w0.254: R35.1 85.52,45.38 84.75,44.61 84.75,37.78 83.96,36.99 72.36,36.99 71.36,37.98 U5.4
C-T4-2: length 18.1
  Bottom Layer w0.254: R36.1 81.71,45.38 80.96,44.62 80.96,37.8 80.57,37.41 73.33,37.41 72.63,38.11 72.63,38.73
C-T4-3: length 37.9
  Inner1 w0.254: v1(89.6,65.52) 76.93,52.86 v1(76.93,49.25)
  Bottom Layer w0.254: 91.44,69.36 91.44,68.54 89.6,66.69 v1(89.6,65.52) ; U5.6 73.9,42.23 76.93,45.26 v1(76.93,49.25)
C-T4-4: length 51.9
  Bottom Layer w0.254: 75.17,38.73 75.17,41.84 77.84,44.5 77.84,84.43 80.77,87.36 R38.1
C-T4-5: length 63.3
  Inner1 w0.254: 78.01,38.22 v1(78.01,33.26)
  Bottom Layer w0.254: R39.1 84.58,86.42 81.03,86.42 78.39,83.78 78.39,38.77 78.01,38.39 v1(78.01,38.22) ; U6.15 80.32,32.96 79.32,31.95 78.62,31.95 78.01,32.56 v1(78.01,33.26)
C-T4-6: length 55.2
  Bottom Layer w0.254: U6.1 79.06,79.2 81.11,81.26 85.06,81.26 85.67,81.88 85.67,83.49 89.33,87.16 R40.1
C-T4-7: length 54.1
  Bottom Layer w0.254: U6.2 80.09,38.97 80.09,65.77 87.98,73.67 87.98,80.41 89.43,81.86 89.43,83.48 93.14,87.19 R41.1
C-T4-8: length 55
  Inner1 w0.254: v1(82.94,47.62) 91.27,55.96 91.27,59.63 93.42,61.78 93.42,72.1 95.05,73.73 v1(95.05,81.82)
  Bottom Layer w0.254: v1(95.05,81.82) 95.05,85.19 96.95,87.09 R42.1 ; v1(82.94,47.62) 82.68,47.37 82.68,42.93 81.59,41.84 U6.3
C-T4-9: length 27.1
  Bottom Layer w0.254: R43.1 87.12,63.95 83.6,60.43 83.6,44.46 83.05,43.9 83.05,38.92 U6.4
C-T4-DP: length 13.8
  Bottom Layer w0.254: U6.5 84.13,46.74 84.56,47.16 88.37,47.16 R34.1
COLON-1: length 7
  Bottom Layer w0.254: NI1.2 47.51,76.9 50.01,79.4 Q45.3
COLON-2: length 7
  Bottom Layer w0.254: Q46.3 50.01,53.9 52.51,56.4 NI2.2
ENCODER-CH1: length 89.1
  Top Layer w0.254: H1.4 98,26.48 98.09,26.39 98.22,26.39 99.1,27.28 99.1,38.47 97.14,40.43 92.15,40.43 88.23,36.51 88.23,32.06 82.16,26 69.83,26 67.83,24 36.15,24 35.82,24.33 35.82,24.62 P1.7
ENCODER-CH2: length 89.8
  Top Layer w0.254: H1.5 98,25.9 98.09,25.99 98.38,25.99 99.51,27.11 99.51,38.64 97.3,40.84 91.98,40.84 87.82,36.68 87.82,32.23 81.99,26.41 69.66,26.41 67.66,24.41 36.32,24.41 36.23,24.5 36.23,24.62 P1.6
ENCODER-SW: length 86.2
  Top Layer w0.254: 32.65,25.46 34.49,23.61 68.06,23.61 70.09,25.64 82.31,25.64 88.58,31.92 88.58,36.36 92.29,40.08 96.68,40.08 97.56,39.2 97.56,36.89 96.27,35.59 96.27,31.4 97.8,29.86 98.04,29.86
ESP-RX: length 46.1
  Top Layer w0.254: P2.7 33.69,9.38 33.69,9.26 40.27,2.67 70.96,2.67 73.27,4.98 73.27,6.16
ESP-TX: length 57.8
  Top Layer w0.254: P2.8 33.28,9.38 33.28,9.09 40.11,2.27 71.23,2.27 74.64,5.68 74.64,6.8 73.93,7.5 72.81,7.5 72.07,8.24 72.07,12.47 70.75,13.8
LDR: length 126.2
  Inner2 w0.254: 36.99,10.44 28.06,19.37 1.78,19.37 0.47,20.67 0.47,85.45 11.84,96.82
  Bottom Layer w0.254: 16.32,96.73 11.81,96.73 11.78,96.76
SW1: length 81.6
  Top Layer w0.254: 29.94,96.99 29.75,96.81 24.89,96.81 12.82,84.74 12.82,26.75 11.79,25.72
SW2: length 79
  Top Layer w0.254: 24.87,25.81 24.87,77.9 38.02,91.05 38.02,95.7 39.06,96.73 41.13,96.73 41.22,96.82
SW3: length 83.2
  Top Layer w0.254: 52.68,96.83 50.52,96.83 49.53,95.83 49.57,95.79 49.57,92.62 40.69,83.74 40.69,39.36 26.95,25.62
SW4: length 86.7
  Top Layer w0.254: 29.8,25.55 29.8,26.58 50.04,46.82 50.04,82.4 58.83,91.19 58.83,91.24 61,93.4 61,95.74 61.99,96.74 64.2,96.74
T1-0: length 10
  Bottom Layer w0.254: Q11.3 18.29,60.3 T1.2
T1-1: length 5.7
  Bottom Layer w0.254: T1.11 6.86,58.52 Q2.3
T1-2: length 10
  Bottom Layer w0.254: T1.10 4.95,55.81 3.05,53.9 Q3.3
T1-3: length 5.1
  Bottom Layer w0.254: Q4.3 6.76,70.23 6.76,68.58 T1.9
T1-4: length 9.8
  Bottom Layer w0.254: T1.8 3.05,73.13 Q5.3
T1-5: length 5.7
  Bottom Layer w0.254: T1.7 6.6,79.15 6.86,79.4 Q6.3
T1-6: length 4.6
  Bottom Layer w0.254: T1.6 Q7.3
T1-7: length 5.6
  Bottom Layer w0.254: T1.5 14.48,74.9 Q8.3
T1-8: length 9.8
  Bottom Layer w0.254: Q9.3 18.29,79.4 16.38,77.5 T1.4
T1-9: length 5
  Bottom Layer w0.254: T1.3 14.58,64.85 14.58,63.25 Q10.3
T1-DP: length 4.6
  Bottom Layer w0.254: T1.12 Q1.3
T2-0: length 10
  Bottom Layer w0.254: T2.2 38.23,55.81 40.13,53.9 Q22.3
T2-1: length 5.7
  Bottom Layer w0.254: T2.11 28.7,58.52 Q13.3
T2-2: length 10
  Bottom Layer w0.254: T2.10 24.89,60.3 Q14.3
T2-3: length 5
  Bottom Layer w0.254: T2.9 28.47,68.45 28.47,70.23 29.35,70.23
T2-4: length 9.8
  Bottom Layer w0.254: Q16.3 24.89,73.13 T2.8
T2-5: length 5.7
  Bottom Layer w0.254: T2.7 28.7,74.9 Q17.3
T2-6: length 4.6
  Bottom Layer w0.254: T2.6 Q18.3
T2-7: length 5.6
  Bottom Layer w0.254: Q19.3 36.32,79.4 36.45,79.27 T2.5
T2-8: length 9.8
  Bottom Layer w0.254: Q20.3 40.13,79.4 38.23,77.5 T2.4
T2-9: length 5.2
  Bottom Layer w0.254: T2.3 36.57,64.99 36.57,62.99 35.69,62.99
T2-DP: length 4.6
  Bottom Layer w0.254: T2.12 Q12.3
T3-0: length 10
  Bottom Layer w0.254: T3.2 75.11,60.3 Q33.3
T3-1: length 5.7
  Bottom Layer w0.254: Q24.3 63.68,58.52 T3.11
T3-2: length 10
  Bottom Layer w0.254: T3.10 60.14,60.57 60.14,54.17 59.87,53.9 Q25.3
T3-3: length 5.2
  Bottom Layer w0.254: Q26.3 63.53,70.36 63.53,68.53 T3.9
T3-4: length 9.8
  Bottom Layer w0.254: T3.8 61.77,77.5 59.87,79.4 Q27.3
T3-5: length 5.7
  Bottom Layer w0.254: T3.7 63.42,79.15 63.68,79.4 Q28.3
T3-6: length 4.6
  Bottom Layer w0.254: T3.6 Q29.3
T3-7: length 5.6
  Bottom Layer w0.254: Q30.3 71.3,74.9 T3.5
T3-8: length 9.8
  Bottom Layer w0.254: T3.4 75.11,73.13 Q31.3
T3-9: length 5.1
  Bottom Layer w0.254: Q32.3 71.5,63.12 71.5,64.94 T3.3
T3-DP: length 4.6
  Bottom Layer w0.254: T3.12 Q23.3
T4-0: length 10
  Bottom Layer w0.254: Q44.3 96.95,53.9 95.05,55.81 T4.2
T4-1: length 5.7
  Bottom Layer w0.254: 85.4,58.65 85.52,58.52 Q35.3
T4-2: length 10
  Bottom Layer w0.254: T4.10 81.71,60.3 Q36.3
T4-3: length 5.2
  Bottom Layer w0.254: Q37.3 85.37,70.36 85.37,68.53 T4.9
T4-4: length 9.8
  Bottom Layer w0.254: Q38.3 81.71,79.4 83.62,77.5 T4.8
T4-5: length 5.7
  Bottom Layer w0.254: Q39.3 85.52,79.4 85.27,79.15 T4.7
T4-6: length 4.6
  Bottom Layer w0.254: T4.6 Q40.3
T4-7: length 5.6
  Bottom Layer w0.254: T4.5 93.14,74.9 Q41.3
T4-8: length 9.8
  Bottom Layer w0.254: Q42.3 96.95,79.4 95.05,77.5 T4.4
T4-9: length 5.2
  Bottom Layer w0.254: Q43.3 93.45,62.99 93.45,65.05 T4.3
T4-DP: length 4.6
  Bottom Layer w0.254: T4.12 Q34.3
T-CLK: length 105.5
  Bottom Layer w0.254: 62.45,33.29 62.45,35.18 61.53,36.09 ; 49.93,36.09 50.85,35.17 50.85,33.28 ; 49.93,36.09 49.9,36.06 40.32,36.06 ; 49.93,36.09 61.53,36.09 ; 27.2,35.62 27.91,34.92 U1.11 ; 27.2,35.62 27.25,35.62 28.17,36.54 39.83,36.54 40.32,36.06 ; 27.2,35.62 26.32,35.62 ; 26.31,35.63 26.31,35.64 ; 26.31,35.63 26.32,35.62 ; 26.31,35.63 21.68,35.63 20.58,34.54 20.58,29.46 19.78,28.65 6.94,28.65 6.61,28.32 6.61,28.03 P1.19 ; 26.32,35.62 26.31,35.62 ; 61.53,36.09 71.54,36.09 ; 71.54,36.09 82.94,36.09 85.44,33.59 ; 71.54,36.09 73.98,33.65 ; 40.32,36.06 39.39,35.14 39.39,33.47
T-CS: length 60.3
  Inner2 w0.254: 26.32,35.01 26.3,35.01 24.05,37.26 13.51,37.26 1.79,25.54 ; v1(37.75,35.58) 37.74,35.59 30.8,35.59 30.21,35 v1(26.33,35) ; 49.91,34.65 49.91,34.65 45,34.65 44.08,35.58 37.75,35.58
  Bottom Layer w0.254: v1(26.33,35) 26.68,34.65 26.68,33.42 ; 38.09,33.28 38.09,35.24 v1(37.75,35.58) ; 49.62,33.21 49.92,33.51 v1(49.92,34.67)
T-CS2: length 91.4
  Inner2 w0.254: v1(59.14,30.36) 59.14,27.99 54.44,23.29 9.3,23.29 6.86,25.73
  Bottom Layer w0.254: 71.93,30.85 83.5,30.85 84.16,31.51 84.16,33.29 84.15,33.3 ; 71.93,30.85 72.64,31.56 72.64,33.25 72.59,33.3 ; 71.93,30.85 71.44,30.36 v1(59.14,30.36) 61.13,32.34 61.13,33.3
T-DA: length 63.7
  Bottom Layer w0.254: 19.95,28.25 53.86,28.25 58.7,33.09 ; 19.95,28.25 24.11,32.4 24.11,33.11 ; 19.95,28.25 7.11,28.25 7.02,28.16 7.02,28.03 P1.17
T-EN: length 79.4
  Top Layer w0.254: v1(82.84,31.49) v1(71.35,31.49) 70.97,31.11 v1(58,31.11) 48.36,31.11 v1(48.34,31.09)
  Inner2 w0.254: 19.64,25.88 24.14,30.38 36.09,30.38 36.86,31.15 48.34,31.15 48.35,31.14
  Bottom Layer w0.254: 59.9,33.19 59.9,33.01 v1(58,31.11) ; 48.41,33.29 48.33,33.21 48.33,31.1 v1(48.34,31.09) ; v1(25.46,30.36) 25.43,30.39 25.43,33.35 ; v1(71.35,31.49) 71.34,31.5 71.34,33.33 ; v1(82.84,31.49) 82.88,31.54 82.88,33.22 ; v1(36.84,31.12) 36.87,31.14 36.87,33.25
TTL-RX: length 11.3
  Top Layer w0.254: 17.06,35.94 14.44,33.31 P1.15
TTL-TX: length 14.3
  Top Layer w0.254: 17,38.58 18.64,36.94 18.64,27.36 P1.14
VFD-CLK: length 83.5
  Top Layer w0.254: P2.10 24.8,12.79 24.8,12.92 34.52,22.64 68.9,22.64 71.07,24.81 83.11,24.81 89.84,31.54 89.84,34.55 91.44,36.15 92.41,36.15 92.5,36.06 H2.2
VFD-CS: length 75.3
  Top Layer w0.254: 29.83,10.88 29.83,17.45 34.25,21.87 68.63,21.87 71.22,24.45 83.25,24.45 90.06,31.26 91.14,31.26 92.36,32.47
VFD-DA: length 84.2
  Top Layer w0.254: H2.1 92.5,36.64 92.41,36.55 91.27,36.55 89.43,34.71 89.43,31.71 82.94,25.21 70.9,25.21 68.73,23.04 34.35,23.04 24.39,13.08 24.39,12.79 P2.12
VFD-EN: length 90.5
  Top Layer w0.254: 24.33,10.83 33.78,1.38 78.89,1.38 87.65,10.13 87.65,23.03 92.39,27.76
VFD-RST: length 102.3
  Top Layer w0.254: 19.27,10.47 20.61,9.13 25.53,9.13 33.63,1.02 79.04,1.02 97.57,19.55 97.57,22.77 93.84,26.5 93.84,28.52 92.5,29.86
$1N458: length 7.6
  Bottom Layer w0.254: 35.62,33.3 35.62,31.93 35.02,31.33 32.33,31.33 30.45,33.22
$1N3740: length 3.2
  Bottom Layer w0.254: R1.2 10.67,49.19 11.62,50.14 11.62,51.02
$1N7569: length 3.2
  Bottom Layer w0.254: 7.81,51.02 7.81,49.97 6.86,49.02 R2.2
$1N7748: length 3.2
  Bottom Layer w0.254: 4,51.02 4,49.97 3.05,49.02 R3.2
$1N7754: length 3.1
  Bottom Layer w0.254: Q4.1 10.52,71.18 10.57,71.23 R4.2
$1N8478: length 3.5
  Bottom Layer w0.254: R5.2 3.05,84.54 2.1,83.59 Q5.1
$1N8484: length 3.5
  Bottom Layer w0.254: Q6.1 5.91,83.59 6.86,84.54 R6.2
$1N8490: length 3.5
  Bottom Layer w0.254: R7.2 10.67,84.54 9.72,83.59 Q7.1
$1N8496: length 3.5
  Bottom Layer w0.254: R8.2 14.61,84.54 13.53,83.46 Q8.1
$1N8764: length 3.5
  Bottom Layer w0.254: R9.2 18.29,84.54 17.34,83.59 Q9.1
$1N8770: length 3.1
  Bottom Layer w0.254: 8.65,62.25 10.77,62.25 10.82,62.3 Q10.1
$1N8776: length 3.2
  Bottom Layer w0.254: 19.24,51.02 19.24,49.97 18.29,49.02 R11.2
$1N9030: length 7.7
  Bottom Layer w0.254: 47.09,33.33 47.09,31.93 46.36,31.2 44.06,31.2 41.98,33.28
$1N10580: length 3.2
  Bottom Layer w0.254: R12.2 32.51,49.19 33.46,50.14 33.46,51.02
$1N10586: length 3.2
  Bottom Layer w0.254: R13.2 28.7,49.19 29.65,50.14 29.65,51.02
$1N10592: length 3.2
  Bottom Layer w0.254: 25.84,51.02 25.84,49.97 24.89,49.02 R14.2
$1N10598: length 3.3
  Bottom Layer w0.254: 31.35,71.18 32.24,71.18 32.29,71.23 R15.2
$1N10604: length 3.5
  Bottom Layer w0.254: R16.2 24.89,84.54 23.94,83.59 Q16.1
$1N10610: length 3.5
  Bottom Layer w0.254: R17.2 28.7,84.54 27.75,83.59 Q17.1
$1N10616: length 3.5
  Bottom Layer w0.254: Q18.1 31.56,83.59 32.51,84.54 R18.2
$1N10622: length 3.5
  Bottom Layer w0.254: R19.2 36.32,84.54 35.37,83.59 Q19.1
$1N10628: length 3.5
  Bottom Layer w0.254: Q20.1 39.18,83.59 40.13,84.54 R20.2
$1N10634: length 3.3
  Bottom Layer w0.254: Q21.1 32.81,62.04 32.76,61.99 30.37,61.99
$1N10640: length 3.2
  Bottom Layer w0.254: 41.08,51.02 41.08,50.14 40.13,49.19 R22.2
$1N12549: length 3.2
  Bottom Layer w0.254: R23.2 67.49,49.19 68.44,50.14 68.44,51.02
$1N12555: length 3.2
  Bottom Layer w0.254: R24.2 63.68,49.02 64.63,49.97 64.63,51.02
$1N12561: length 3.2
  Bottom Layer w0.254: 60.82,51.02 60.82,49.97 59.87,49.02 R25.2
$1N12567: length 3.2
  Bottom Layer w0.254: 69.6,71.33 67.31,71.33 67.29,71.31 66.41,71.31
$1N12573: length 3.5
  Bottom Layer w0.254: Q27.1 58.92,83.59 59.87,84.54 R27.2
$1N12579: length 3.5
  Bottom Layer w0.254: Q28.1 62.73,83.59 63.68,84.54 R28.2
$1N12585: length 3.5
  Bottom Layer w0.254: R29.2 67.49,84.11 66.54,83.16 Q29.1
$1N12591: length 3.5
  Bottom Layer w0.254: Q30.1 70.35,83.59 71.3,84.54 R30.2
$1N12597: length 3.5
  Bottom Layer w0.254: Q31.1 74.16,83.59 75.11,84.54 R31.2
$1N12603: length 3.2
  Bottom Layer w0.254: 65.42,62.12 66.37,62.12 66.42,62.17 68.61,62.17
$1N12609: length 3.2
  Bottom Layer w0.254: 76.06,51.02 76.06,50.14 75.11,49.19 R33.2
$1N12615: length 3.2
  Bottom Layer w0.254: R34.2 89.33,49.19 90.28,50.14 90.28,51.02
$1N12621: length 3.2
  Bottom Layer w0.254: R35.2 85.52,49.02 86.47,49.97 86.47,51.02
$1N12627: length 3.2
  Bottom Layer w0.254: 82.66,51.02 82.66,49.97 81.71,49.02 R36.2
$1N12633: length 3.2
  Bottom Layer w0.254: 88.25,71.31 89.13,71.31 89.18,71.36 91.44,71.36
$1N12639: length 3.5
  Bottom Layer w0.254: R38.2 81.71,84.54 80.76,83.59 Q38.1
$1N12645: length 3.5
  Bottom Layer w0.254: R39.2 85.52,84.54 84.57,83.59 Q39.1
$1N12651: length 3.5
  Bottom Layer w0.254: Q40.1 88.38,83.59 89.33,84.54 R40.2
$1N12657: length 3.5
  Bottom Layer w0.254: Q41.1 92.19,83.59 93.14,84.54 R41.2
$1N12663: length 3.5
  Bottom Layer w0.254: Q42.1 96,83.59 96.95,84.54 R42.2
$1N12669: length 3.5
  Bottom Layer w0.254: 90.57,62.04 88.14,62.04 88.07,62.12 87.12,62.12
$1N12675: length 3.2
  Bottom Layer w0.254: 97.9,51.02 97.9,49.97 96.95,49.02 R44.2
$1N19417: length 5.6
  Bottom Layer w0.254: R45.2 50.01,87.13 48.88,86 48.88,82.46 Q45.1
$1N43535: length 3.2
  Bottom Layer w0.254: 50.96,51.02 50.96,50.14 50.01,49.19 R46.2
$1N54382: length 7.6
  Bottom Layer w0.254: 76.41,33.38 78.48,31.31 80.94,31.31 81.6,31.97 81.6,33.22
$1N105872: length 10.5
  Bottom Layer w0.635: 14.62,58.64 14.52,58.54 14.52,48.22
$1N105896: length 10.3
  Bottom Layer w0.635: 36.24,58.67 36.28,58.63 36.28,48.37
$1N105920: length 10.2
  Bottom Layer w0.635: 71.35,48.38 71.35,58.54 71.38,58.57
$1N105944: length 10.4
  Bottom Layer w0.635: 93.11,48.23 93.11,58.57 93.08,58.6
$1N105947: length 10.9
  Bottom Layer w0.635: 47.51,59.02 47,58.51 47,48.35
$1N105948: length 27.4
  Bottom Layer w0.635: 52.53,74.32 54.61,72.24 54.61,50.09 52.98,48.47
$1N167698: length 6.8
  Bottom Layer w0.254: 81.09,11 78.63,11 78.63,7.81 78.29,7.47 77.66,7.47
$1N177857: length 7.4
  Bottom Layer w0.254: 64.95,33.3 66.78,31.47 69.52,31.47 70.12,32.07 70.12,33.26

## Copper pours and planes (outline as drawn; the poured copper is in the pictures)
GND on Top Layer: -9.86,107.64 108.35,107.64 108.35,-6.25 -9.86,-6.25
GND on Bottom Layer: -24.38,118.74 123.17,118.74 123.17,-18.19 -24.38,-18.19
GND on Inner1: -13.19,104.93 112.1,104.93 112.1,-10.78 -13.19,-10.78
GND on Inner2: -17.76,113.15 117.58,113.15 117.58,-13.97 -17.76,-13.97

## Text on the board
Bottom Silkscreen Layer: JLCJLCJLCJLC | GND | COLON-1 | COLON-2 | VFD-RST | VFD-DA | VFD-EN | VFD-CLK | ESP-TX | ESP-RX | LDR | Buz | VBAT | T-CS | T-CLK | T-CS2 | T-DA | SW1 | TTL-RX | TTL-TX | T-EN | SW2 | SW3 | SW4 | E-SW | E-CH1 | E-CH2 | AHT10-SCL | AHT10-SDA | 5V | Buz-GND | 3V3 | VFD-CS | AHT10 | Encoder | BluePill | USB-TTL
Top Silkscreen Layer: 5V | GND | 170V | ESP-01S | VFD | Smart Nixie Clock V1
